# Altium schematic sheet LNA_LNANXPSOT1209_v1.SchDoc
size A4
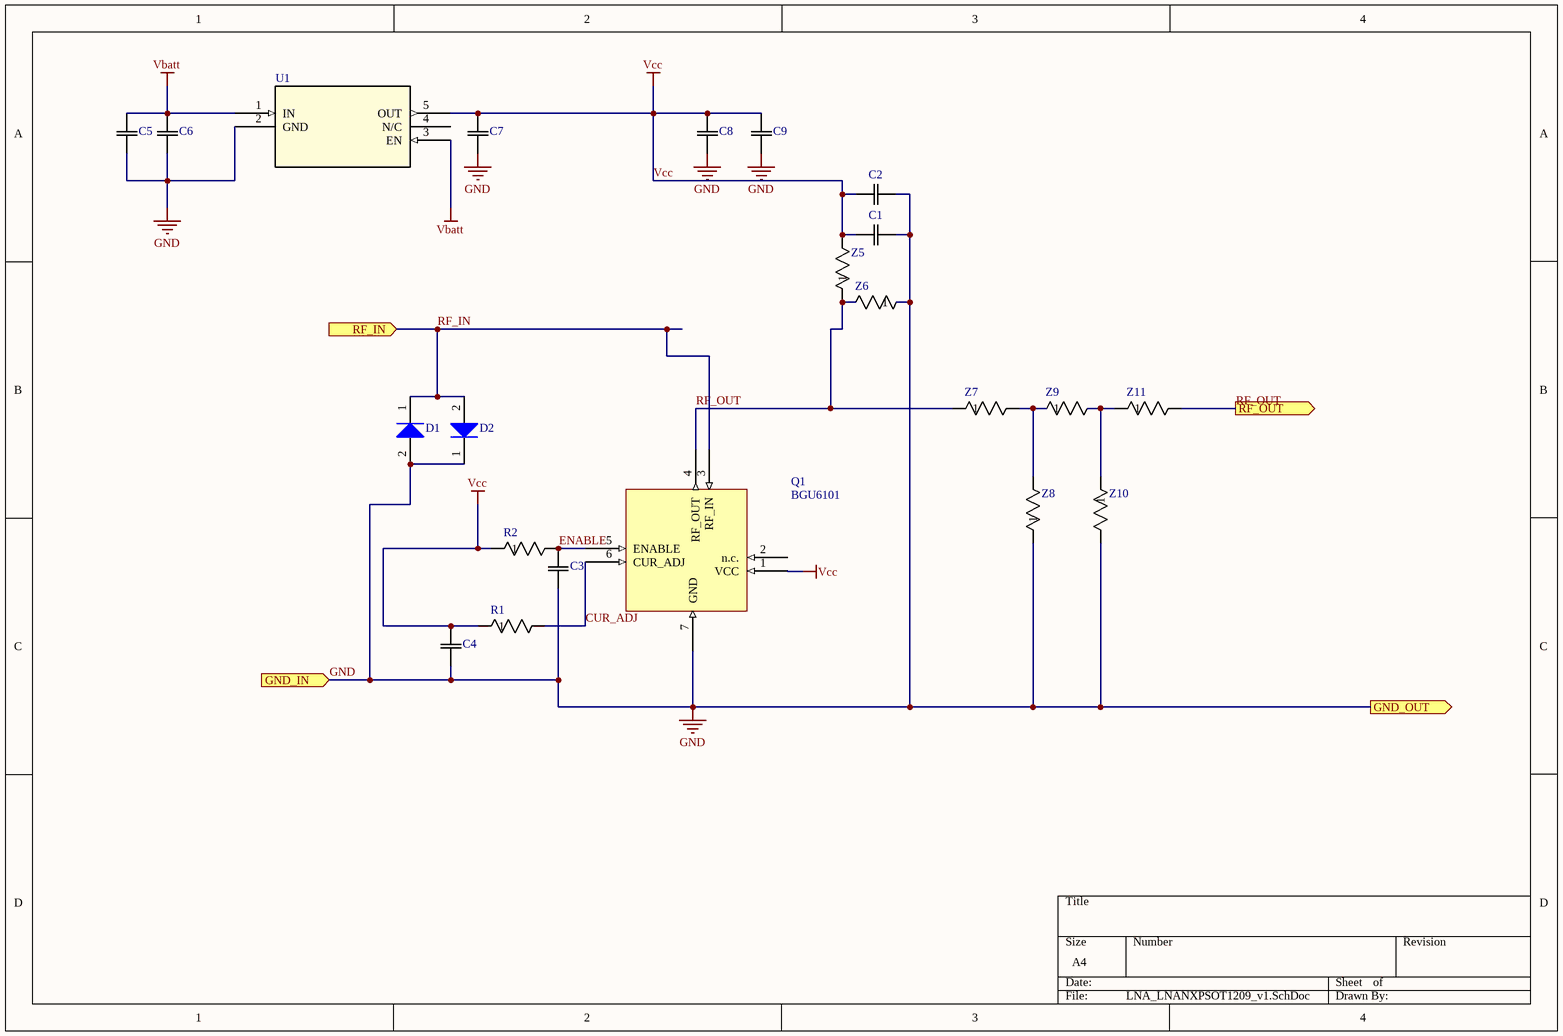
[diagram p0: LNA_LNANXPSOT1209_v1.SchDoc]

## Parts
C1  (no value)  [C0201]
C2  (no value)  [C0201]
C3  (no value)  [C0201]
C4  (no value)  [C0201]
C5  (no value)  [YAG_CC0402]
C6  (no value)  [YAG_CC0402]
C7  (no value)  [YAG_CC0402]
C8  (no value)  [C0201]
C9  (no value)  [C0201]
D1  (no value)  [INF-SOD323_V]
D2  (no value)  [INF-SOD323_V]
Q1  BGU6101  [*PSON50P130X200X35-7N]
R1  (no value)  [RES_RC0201_P6XP3]
R2  (no value)  [RES_RC0201_P6XP3]
U1  (no value)  [DBV5]
Z5  (no value)  [RES_RC0201_P6XP3]
Z6  (no value)  [RES_RC0201_P6XP3]
Z7  (no value)  [RES_RC0201_P6XP3]
Z8  (no value)  [RES_RC0201_P6XP3]
Z9  (no value)  [RES_RC0201_P6XP3]
Z10  (no value)  [RES_RC0201_P6XP3]
Z11  (no value)  [RES_RC0201_P6XP3]

## Ports
GND_IN (in), GND_OUT (out), RF_IN (in), RF_OUT (out)

## Nets
GND: C1.2 C2.2 C3.1 C4.2 C5.2 C6.2 C7.2 C8.2 C9.2 D1.2(A) D2.1(K) Q1.7(GND) U1.2(GND) Z6.1 Z8.1 Z10.2 ; port GND_IN, port GND_OUT
Vbatt: C5.1 C6.1 U1.1(IN) U1.3(EN)
Vcc: C1.1 C2.1 C4.1 C7.1 C8.1 C9.1 Q1.1(VCC) R1.1 R2.1 U1.5(OUT) Z5.2
CUR_ADJ: Q1.6(CUR_ADJ) R1.2
ENABLE: C3.2 Q1.5(ENABLE) R2.2
RF_IN: D1.1(K) D2.2(A) Q1.3(RF_IN) ; port RF_IN
RF_OUT: Q1.4(RF_OUT) Z5.1 Z6.2 Z7.1 Z11.2 ; port RF_OUT
NetZ7_2: Z7.2 Z8.2 Z9.1
NetZ9_2: Z9.2 Z10.1 Z11.1

Not connected (* = marked no-connect by the designer): Q1 2(n.c.); U1 4(N/C)

## Library data of the parts
C1-C9 = C0201C270J3GACTU: No Description Available; Vendor: Kemet; Built_By: EMA_UL_Team; Type: DEV; Manufacturer_Part_Number: C0201C270J3GACTU; Copyright: Copyright (C) 2018 Accelerated Designs. All rights reserved; RefDes: RefDes; Value: Value
D1 D2 = BAT15-03W: Single Silicon Schottky Diode, 110 mA IF Max, SOD32, Green; Manufacturer: Infineon; CT (typ): 0.26 pF; Green: yes; Group: RF Mixer; IF (max): 110 mA; VF (typ): 0.23 V; VR (max): 4 V; DatasheetVersion: Jun-2011; PackageReference: SOD323; PackageDescription: 2-Pin Small Outline Diode Package, 1.25 x 1.7 mm Body; Supplier 1: Mouser; Supplier Part Number 1: N/A; Configuration: Single; Mounting Technology: Surface Mount; PartNumber: BAT15-03W; ComponentLink1Description: Manufacturer URL; ComponentLink1URL: http://www.infineon.com/; ComponentLink2Description: Datasheet; ComponentLink2URL: http://www.infineon.com/dgdl/bat15series.pdf?folderId=db3a304314dca3890114ff6812070b44&fileId=db3a304314dca3890114ff6b74ca0b48&location=en.Products.RF.RF_Mixer___Detector_Schottky_Diodes.DATASHEET.bat15series.pdf; ComponentLink3Description: Package Specification; ComponentLink3URL: http://www.infineon.com/dgdl/SOD323-Package_Overview.pdf?folderId=db3a30431936bc4b011952aab84f3bbe&fileId=db3a30431936bc4b011952beed653be3
R1 R2 Z5-Z11 = RC0201FR-0718KL: No Description Available; Vendor: Yageo; Built_By: EMA_Anthony; Copyright: Copyright (C) 2018 Accelerated Designs. All rights reserved; Manufacturer_Part_Number: RC0201FR-0718KL; RefDes: RefDes; Type: DEV; Value: Value
U1 = LP5907MFX-3.3/NO: No Description Available; Manufacturer_Part_Number: LP5907MFX-3.3/NOPB; Vendor: Texas Instruments; Built_By: EMA_UL_Team; Copyright: Copyright (C) 2018 Accelerated Designs. All rights reserved; RefDes: RefDes; Type: DEV; Value: Value